# EAGLE design USB_RS485 (EAGLE 6.2)
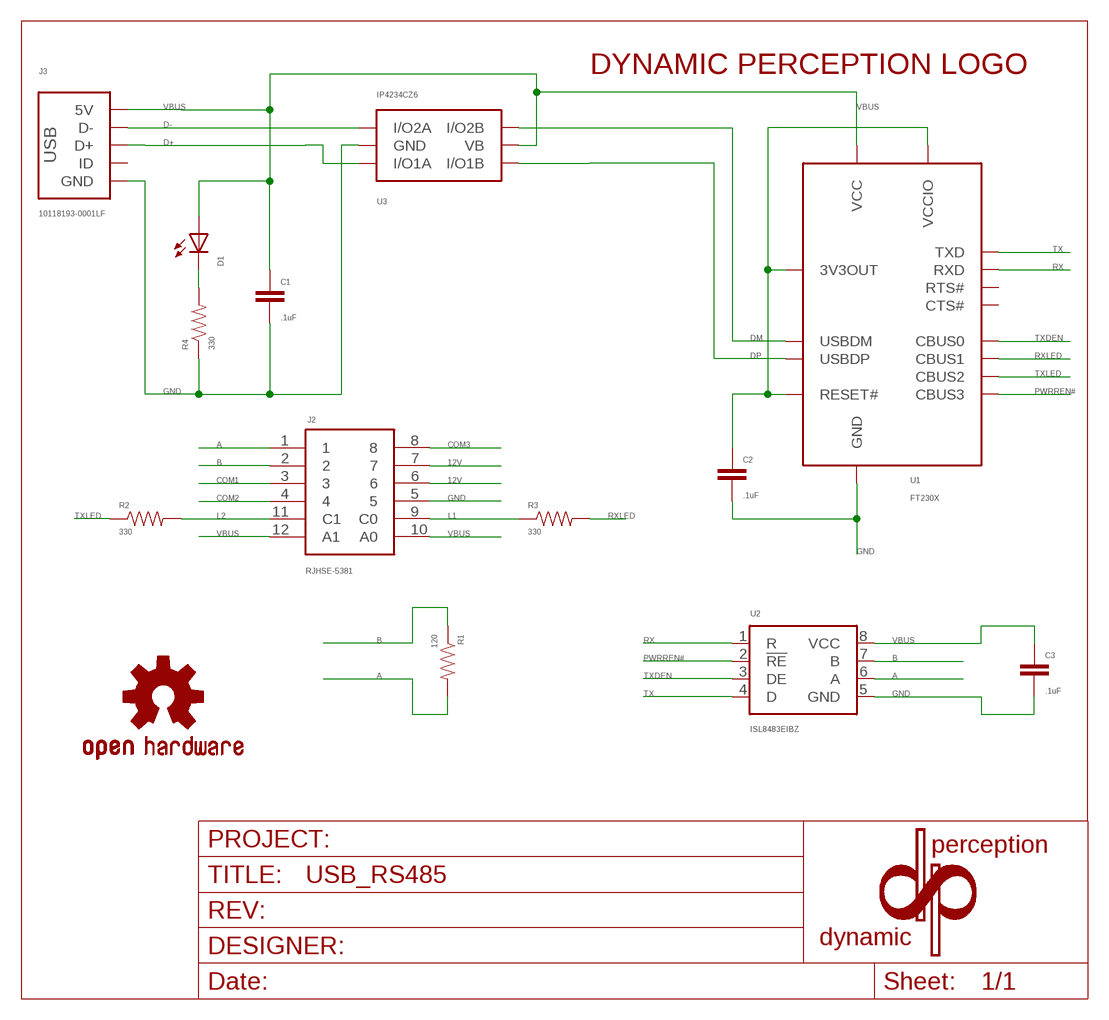
[diagram p0: schematic, sheet 1]

## Parts
C1  .1uF  CAP_NONPOL0402  [0402_CAP]
C2  .1uF  CAP_NONPOL0402  [0402_CAP]
C3  .1uF  CAP_NONPOL0402  [0402_CAP]
D1  LEDSML0603  [SML0603]
J2  RJHSE-5381  RJHS-538X  [RIGHT_ANGLE]
J3  10118193-0001LF  USB10118193-0001LF  [10118193-0001LF]
LOGO1  DP_LOGOSMALL  [DP_LOGO_SMALL]
R1  120  RESISTOR0402  [0402_RES]
R2  330  RESISTOR0402  [0402_RES]
R3  330  RESISTOR0402  [0402_RES]
R4  330  RESISTOR0402  [0402_RES]
U1  FT230X  FT230XSSOP-16  [SSOP-16]
U2  ISL8483EIBZ  SN65176D  [SO-08]
U3  IP4234CZ6  IP4234CZ6SOT-457  [SOT-457]
U$1  OSHW-LOGOS  [OSHW-LOGO-S]
U$2  DP_FRAME  [DP_FRAME]

## Nets
12V: J2.6 J2.7
A: J2.1 R1.2 U2.6(A)
B: J2.2 R1.1 U2.7(B)
COM1: J2.3
COM2: J2.4
COM3: J2.8
D+: J3.3(D+) U3.1(I/O1A)
D-: J3.2(D-) U3.6(I/O2A)
DM: U1.9(USBDM) U3.4(I/O2B)
DP: U1.8(USBDP) U3.3(I/O1B)
GND: C1.2 C2.2 C3.2 J2.5 J3.5(GND) J3.S1(GND) J3.S2(GND) J3.S3(GND) J3.S4(GND) R4.1 U1.5(GND) U1.13(GND) U2.5(GND) U3.2(GND)
L1: J2.9(C0) R3.1
L2: J2.11(C1) R2.2
N$1: D1.C R4.2
N$2: C2.1 U1.3(VCCIO) U1.10(3V3OUT) U1.11(RESET#)
PWRREN#: U1.16(CBUS3) U2.2(!RE)
RX: U1.4(RXD) U2.1(R)
RXLED: R3.2 U1.14(CBUS1)
TX: U1.1(TXD) U2.4(D)
TXDEN: U1.15(CBUS0) U2.3(DE)
TXLED: R2.1 U1.7(CBUS2)
VBUS: C1.1 C3.1 D1.A J2.10(A0) J2.12(A1) J3.1(5V) U1.12(VCC) U2.8(VCC) U3.5(VB)
Unconnected: J3.4(ID) U1.2(RTS#) U1.6(CTS#)

## Library data of the parts
C1-C3 = parkers_parts:CAP_NONPOL
D1 = led:LED: LED OSRAM: - CHIPLED LG R971, LG N971, LY N971, LG Q971, LY Q971, LO R971, LY R971 LH N974, LH R974 LS Q976, LO Q976, LY Q976 LO Q996 - Hyper CHIPLED LW Q18S LB Q993, LB Q99A, LB R99A - SideLED LS A670, LO A670, LY A670, LG A670, LP A670 LB A673, LV A673, LT A673, LW A673 LH A674 LY A675 LS A676, LA A676, LO A676, LY A676, LW A676 LS A679, LY A679, LG A679 - Hyper Micro SIDELED® LS Y876, LA Y876, LO Y876, LY Y876 LT Y87S - SmartLED LW L88C, LW L88S LB L89C, LB L89S, LG L890 LS L89K, LO L89K, LY L89K LS L896, LA L896, LO L896, LY L896 - TOPLED LS T670, LO T670, LY T670, LG T670, LP T670 LSG T670, LSP T670, LSY T670, LOP T670, LYG T670 LG T671, LOG T671, LSG T671 LB T673, LV T673, LT T673, LW T673 LH T674 LS T676, LA T676, LO T676, LY T676, LB T676, LH T676, LSB T676, LW T676 LB T67C, LV T67C, LT T67C, LS T67K, LO T67K, LY T67K, LW E67C LS E67B, LA E67B, LO E67B, LY E67B, LB E67C, LV E67C, LT E67C LW T67C LS T679, LY T679, LG T679 LS T770, LO T770, LY T770, LG T770, LP T770 LB T773, LV T773, LT T773, LW T773 LH T774 LS E675, LA E675, LY E675, LS T675 LS T776, LA T776, LO T776, LY T776, LB T776 LHGB T686 LT T68C, LB T68C - Hyper Mini TOPLED® LB M676 - Mini TOPLED Santana® LG M470 LS M47K, LO M47K, LY M47K Source: http://www.osram.convergy.de LUXEON: - LUMILED® LXK2-PW12-R00, LXK2-PW12-S00, LXK2-PW14-U00, LXK2-PW14-V00 LXK2-PM12-R00, LXK2-PM12-S00, LXK2-PM14-U00 LXK2-PE12-Q00, LXK2-PE12-R00, LXK2-PE12-S00, LXK2-PE14-T00, LXK2-PE14-U00 LXK2-PB12-K00, LXK2-PB12-L00, LXK2-PB12-M00, LXK2-PB14-N00, LXK2-PB14-P00, LXK2-PB14-Q00 LXK2-PR12-L00, LXK2-PR12-M00, LXK2-PR14-Q00, LXK2-PR14-R00 LXK2-PD12-Q00, LXK2-PD12-R00, LXK2-PD12-S00 LXK2-PH12-R00, LXK2-PH12-S00 LXK2-PL12-P00, LXK2-PL12-Q00, LXK2-PL12-R00 Source: www.luxeon.com KINGBRIGHT: KA-3528ASYC Source: www.kingbright.com
J2 = amphenol ethernet:RJHS-538X: RJHS-538X series right-angle ethernet (RJ45) connector with two LEDs
J3 = PP_Connectors:USB
LOGO1 = parkers_parts:DP_LOGO
R1-R4 = parkers_parts:RESISTOR
U1 = PP_DigitalIC:FT230X: Manufacturer Part #: FT230XS-R Manufacturer: FTDI Description: USB Interface IC USB to Basic Serial UART IC SSOP-16
U2 = texas:SN65176: DIFFERENTIAL BUS TRANSCEIVER Source: http://focus.ti.com .. sn65176b.pdf; MF: TEXAS INSTRUMENTS; MPN: SN65176BD; OC_FARNELL: 9589970; OC_NEWARK: 08F5891
U3 = PP_Passives:IP4234CZ6: Mouser Part #: 771-IP4234CZ6125 Manufacturer Part #: IP4234CZ6,125 Manufacturer: NXP Semiconductors Description: ESD Suppressors Single USB 2.0 ESD Protection 6-Pin http://www.mouser.com/ProductDetail/NXP-Semiconductors/IP4234CZ6125/?qs=sGAEpiMZZMvxHShE6Whpu7QUdHOfUl1T0xbl582qhFk%3d
U$1 = SparkFun-Aesthetics:OSHW-LOGO: Open Source Hardware Logo This logo indicates the piece of hardware it is found on incorporates a OSHW license and/or adheres to the definition of open source hardware found here: http://freedomdefined.org/OSHW
U$2 = parkers_parts:DP_FRAME; DNAME: PARKER DILLMANN; PNAME: USB -> RS485; REVNUM: 8

## Board
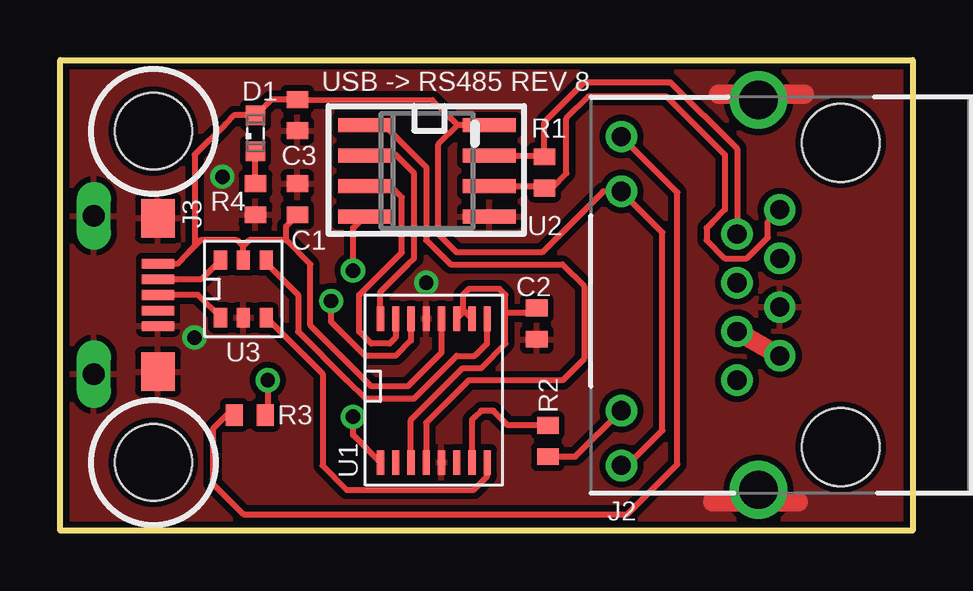
[diagram p1: board, top side]
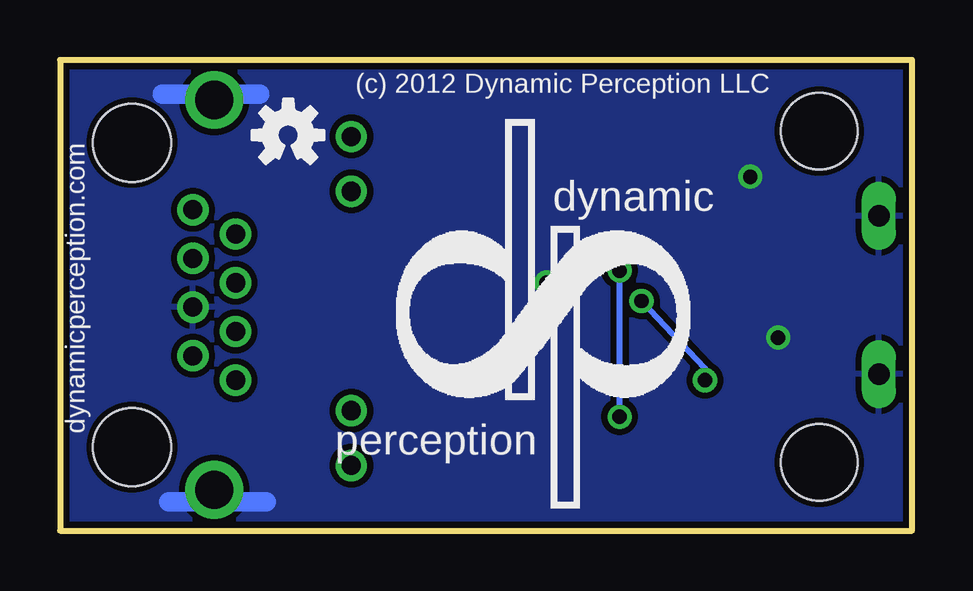
[diagram p2: board, bottom side, seen from below]

Size 35.51 x 19.63 mm. Coordinates in mm from the lower left corner, seen from the top.
Outline: 0,19.63 35.51,19.63 35.51,0 0,0 0,19.63
Copper layers (1*16): Top 0.035mm / dielectric 1.5mm / Bottom 0.035mm
Design rules: minimum track width 7mil, minimum drill 8mil, track to track 7mil, track to pad 7mil, pad to pad 7mil, via to via 7mil, smd to smd 7mil, copper to edge 10mil, drill to drill 8mil, minimum pad ring 10mil, minimum via ring 8mil, stop-mask expansion 4mil, vias tented up to drill 25mil, thermal gap 10mil
Holes 3.2 mm at 3.87,2.84 3.87,16.66

### Footprints (pad centres in the part's own frame; a part is rotated, then mirrored left to right if it is on the bottom)
0402_CAP = smd 0.7 x 0.9: 1 -0.65,0; 2 0.65,0
SML0603 = smd 0.8 x 0.8: A 0.75,0; C -0.75,0
RIGHT_ANGLE = drill 0.8: 1 9.906,2.54; 2 8.89,4.32; 3 7.874,2.54; 4 6.858,4.32; 5 5.842,2.54; 6 4.826,4.32; 7 3.81,2.54; 8 2.794,4.32; 9 12.954,9.14; 10 10.668,9.14; 11 1.524,9.14; 12 -0.762,9.14 | drill 1.6: P$1 -1.778,3.43; P$2 14.478,3.43 | hole 3.251: 0,0; 12.7,0
10118193-0001LF = smd 0.4 x 1.35: 1 -1.3,2.54; 2 -0.65,2.54; 3 0,2.54; 4 0.65,2.54; 5 1.3,2.54 | drill 0.9 long: S1 -3.3,-0.135; S2 3.3,-0.135 | smd 1.6 x 1.4: S3 -3.2,2.54; S4 3.2,2.54
0402_RES = smd 0.7 x 0.9: 1 -0.65,0; 2 0.65,0
SSOP-16 = smd 0.305 x 1.016: 1 -1.905,-3.175; 2 -1.27,-3.175; 3 -0.635,-3.175; 4 0,-3.175; 5 0.635,-3.175; 6 1.27,-3.175; 7 1.905,-3.175; 8 2.54,-3.175; 9 2.54,2.819; 10 1.905,2.819; 11 1.27,2.819; 12 0.635,2.819; 13 0,2.819; 14 -0.635,2.819; 15 -1.27,2.819; 16 -1.905,2.819
SO-08 = smd 0.6 x 2.2: 1 -1.905,-2.6; 2 -0.635,-2.6; 3 0.635,-2.6; 4 1.905,-2.6; 5 1.905,2.6; 6 0.635,2.6; 7 -0.635,2.6; 8 -1.905,2.6
SOT-457 = smd 0.8 x 0.55: 1 -1.2,0.95; 2 -1.2,0; 3 -1.2,-0.95; 4 1.2,-0.95; 5 1.2,0; 6 1.2,0.95

### Placement (x,y rotation side)
C1  9.87,13.82 90 top
C2  19.85,8.63 270 top
C3  9.87,17.33 270 top
D1  8.13,16.57 90 top
J2  32.51,3.48 90 top
J3  1.52,9.83 270 top
LOGO1  9.27,17.13 180 bottom
R1  20.16,14.94 270 top
R2  20.31,3.74 270 top
R3  7.89,4.82 0 top
R4  8.13,13.82 90 top
U1  15.24,6.02 0 top
U2  15.27,15.01 270 top
U3  7.62,10.08 90 top
U$1  26,16.5 0 bottom
U$2  1.87,-0.67 0 top

### Tracks (layer width: path | path; a pad name or v marks a point on that pad's centre or on a via)
12V
  Top 0.813: J2.6 J2.7
A
  Top 0.254: U2.6 20.08,14.37 R1.2 20.46,14.29 21.08,14.91 21.08,17.2 22.01,18.12 25.24,18.12 27.69,15.67 27.69,13.39 27.18,12.88 26.92,12.62 26.92,12.12 27.69,11.35 28.6,11.35 29.47,12.23 29.47,12.89 J2.1
B
  Top 0.254: U2.7 20.11,15.64 R1.1 20.16,17.04 21.83,18.7 25.42,18.7 28.19,15.93 J2.2
D+
  Top 0.254: U3.1 5.72,9.83 J3.3
D-
  Top 0.254: U3.6 5.87,10.48 J3.2
DM
  Top 0.254: U1.9 17.78,7.8 17.27,7.29 16.51,7.29 14.73,5.51 14.34,5.51 12.7,5.51 11.94,6.27 9.91,8.31 9.91,9.83 8.57,11.17 U3.4
DP
  Top 0.254: U3.3 10.92,6.53 10.92,2.72 11.94,1.7 17.21,1.7 17.78,2.27 U1.8
GND  (via drill 0.6)
  Top 0.813: 30.99,18.21 27.43,18.21 | 30.73,1.19 27.18,1.19
  Bottom 0.813: 26.92,1.19 30.99,1.19 | 27.18,18.21 31.24,18.21
  other vias: 6.75,14.76 5.59,8.05 15.24,10.34
  pour Top (isolate 0.254, rank 6): 0.38,19.64 35.37,19.64 35.37,0.02 0.38,0.02
  pour Bottom (isolate 0.254, rank 6): 0.38,19.64 35.37,19.64 35.37,0.02 0.38,0.02
L1
  Top 0.254: R3.1 6.93,4.82 6.35,4.24 6.35,1.96 7.62,0.69 23.62,0.69 25.71,2.77 25.71,14.1 J2.9
L2
  Top 0.254: R2.2 21.46,3.09 J2.11
N$1
  Top 0.254: R4.2 D1.C
N$2
  Top 0.254: U1.3 14.61,4.62 16.76,6.78 17.53,6.78 18.54,7.8 18.54,9.07 | 18.54,9.07 18.54,9.83 18.29,10.08 17.02,10.08 16.76,9.83 16.76,9.32 | 16.76,9.32 16.76,9.09 U1.11 | U1.10 16.76,9.22 16.76,9.32 | C2.1 19.63,9.07 18.54,9.07
PWRREN#
  Top 0.254: U1.16 13.34,9.96 14.48,11.1 14.73,11.35 14.73,14.91 13.97,15.67 12.7,15.67 U2.2
RX
  Top 0.254: U2.1 13.49,16.91 15.24,15.16 15.24,12.12 16.26,11.1 20.92,11.1 21.82,10.2 21.82,7.17 20.92,6.27 17.02,6.27 15.24,4.5 U1.4
RXLED  (via drill 0.6)
  Top 0.254: U1.14 14.61,7.92 13.97,7.29 12.7,7.29 11.28,8.71 v11.28,9.58 | v8.64,6.27 8.64,4.92 R3.2
  Bottom 0.254: v11.28,9.58 8.64,6.78 v8.64,6.27
TX  (via drill 0.6)
  Top 0.254: U1.1 12.19,3.99 v12.19,4.75 | v12.19,10.85 12.19,12.62 U2.4
  Bottom 0.254: v12.19,4.75 v12.19,10.85
TXDEN
  Top 0.254: U1.15 13.97,8.05 13.72,7.8 12.95,7.8 12.45,8.31 12.45,9.83 14.22,11.61 14.22,13.89 13.72,14.4 12.7,14.4 U2.3
TXLED
  Top 0.254: R2.1 18.65,4.39 18.03,5 17.53,5 17.27,4.75 17.14,4.62 U1.7
VBUS
  Top 0.254: 5.59,11.86 5.33,11.61 4.86,11.13 J3.1 | U2.8 17.54,16.91 16.55,16.91 | 5.59,11.86 5.59,15.67 6.86,16.94 7.23,17.32 D1.A 8.79,17.98 C3.1 15.5,17.96 16.13,17.32 | U3.5 7.62,11.86 | 7.62,11.86 7.37,12.12 5.84,12.12 5.59,11.86 | 16.26,17.2 16.13,17.32 | 16.55,16.91 16.13,17.32 | U1.12 15.88,7.42 14.48,6.02 12.95,6.02 10.41,8.56 10.41,11.1 9.4,12.12 | 9.4,12.12 7.87,12.12 7.62,11.86 | 9.4,12.12 9.4,12.7 C1.1 | 16.55,16.91 15.75,16.11 15.75,12.37 16.51,11.61 20.07,11.61 22.61,14.15 22.86,14.15 J2.10 25.08,12.44 25.08,4.18 23.62,2.72 J2.12

### Text on the board
tPlace: USB -> RS485 REV 8
bPlace: (c) 2012 Dynamic Perception LLC | dynamicperception.com